# Altium schematic sheet Ethernet Con.SchDoc: Scuba Doo Ethernet
size B; Organization: CWRUbotix; Address1: 10900 Euclid Avenue; Address2: Cleveland, OH 44106; Address3: USA; SheetNumber: 5; SheetTotal: 7
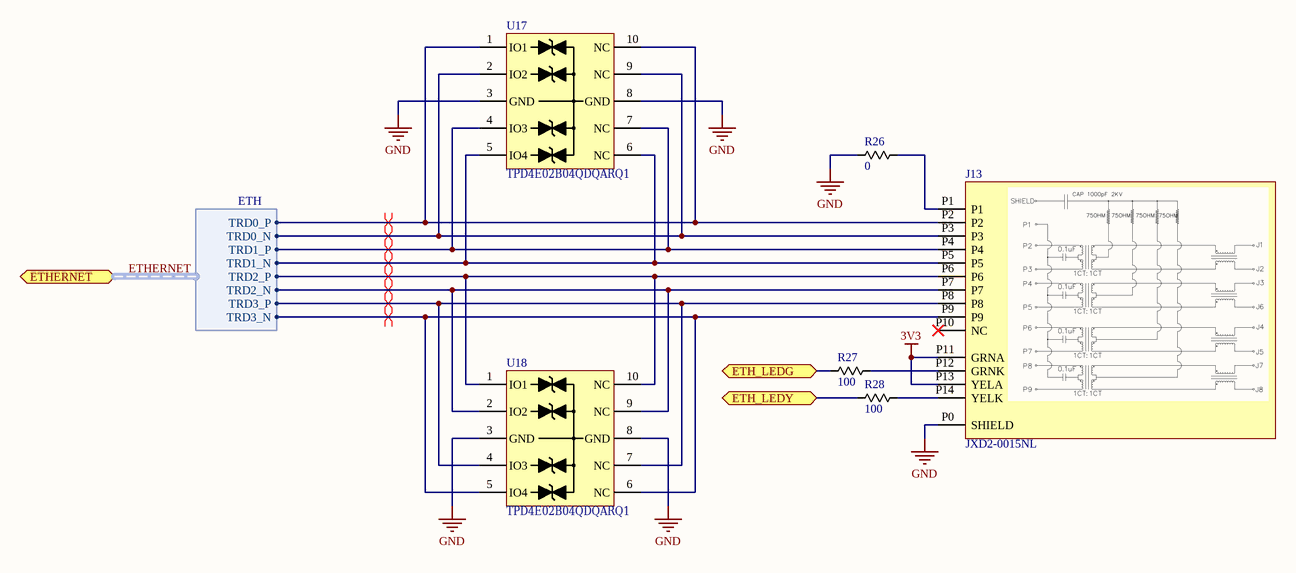
[diagram p0: Ethernet Con.SchDoc]

## Parts
J13  JXD2-0015NL  [PULSE_JXD2-0015NL]
R26  0  [chip_0805]
R27  100  [chip_0603]
R28  100  [chip_0603]
U17  TPD4E02B04QDQARQ1‎  [USON-10]
U18  TPD4E02B04QDQARQ1‎  [USON-10]

## Ports
ETH_LEDG (bidir), ETH_LEDY (bidir), ETHERNET (bidir, harness ETH)

## Harnesses
ETH: TRD0_P, TRD0_N, TRD1_N, TRD1_P, TRD2_P, TRD2_N, TRD3_P, TRD3_N

## Nets
3V3: J13.P11(GRNA) J13.P13(YELA)
GND: J13.P0(SHIELD) R26.1 U17.3(GND) U17.8(GND) U18.3(GND) U18.8(GND)
ETH_LEDG: R27.1 ; port ETH_LEDG
ETH_LEDY: R28.1 ; port ETH_LEDY
ETHERNET.TRD0_N: J13.P3 U17.2(IO2) U17.9(NC) ; port ETHERNET.TRD0_N
ETHERNET.TRD0_P: J13.P2 U17.1(IO1) U17.10(NC) ; port ETHERNET.TRD0_P
ETHERNET.TRD1_N: J13.P5 U17.5(IO4) U17.6(NC) ; port ETHERNET.TRD1_N
ETHERNET.TRD1_P: J13.P4 U17.4(IO3) U17.7(NC) ; port ETHERNET.TRD1_P
ETHERNET.TRD2_N: J13.P7 U18.2(IO2) U18.9(NC) ; port ETHERNET.TRD2_N
ETHERNET.TRD2_P: J13.P6 U18.1(IO1) U18.10(NC) ; port ETHERNET.TRD2_P
ETHERNET.TRD3_N: J13.P9 U18.5(IO4) U18.6(NC) ; port ETHERNET.TRD3_N
ETHERNET.TRD3_P: J13.P8 U18.4(IO3) U18.7(NC) ; port ETHERNET.TRD3_P
NetJ13_P1: J13.P1 R26.2
NetJ13_P12: J13.P12(GRNK) R27.2
NetJ13_P14: J13.P14(YELK) R28.2

Not connected (* = marked no-connect by the designer): J13 P10(NC)*

## Buses and harness runs
harness ETHERNET = port ETHERNET

## Layout directives
differential pair; differential pair class ETHERNET: ETHERNET.TRD0_N, ETHERNET.TRD0_P, ETHERNET.TRD1_N, ETHERNET.TRD1_P, ETHERNET.TRD2_N, ETHERNET.TRD2_P, ETHERNET.TRD3_N, ETHERNET.TRD3_P

## Notes on the sheet
- Title
- Size:
- B
- Number:
- Revision:
- Date:
- Sheet
- of

## Library data of the parts
J13 = CONN-00115: RJ45 Modular Mag-jack, 8P8C, 1000 Base-T, Vertical; Manufacturer: Pulse Electronics Network; Positions per level: 8; Levels: 1; Part Number: CONN-00115; Type: Jack; Manufacturer PN: JXD2-0015NL; Cost: 7.63
R26 = RES-00720: RES SMD 0 OHM 1/8W 0805 Thick Film; Manufacturer: Stackpole; Manufacturer PN: RMCF0805ZT0R00; Tolerance: Jumper; Part Number: RES-00720; Resistance: 0; Power Rating: 1/8W; Cost: 0.1
R27 R28 = RES-00178: RES SMD 100 OHM 1% 1/4W 0603; Manufacturer: Panasonic; Manufacturer PN: ERJ-PA3F1000V; Power Rating: 0.25W; Part Number: RES-00178; Resistance: 100; Tolerance: 1%
U17 U18 = DIO-00068: TVS, 4-Ch, ESD Protec, 3.6V 8.8V 10-USON; Manufacturer: TI; Manufacturer PN: TPD4E02B04DQAR; Power Rating: 17W; Current Rating: 2A; Part Number: DIO-00068; Type: TVS; Cost: 0.56